# EAGLE design lichtschranke (EAGLE 5.10)
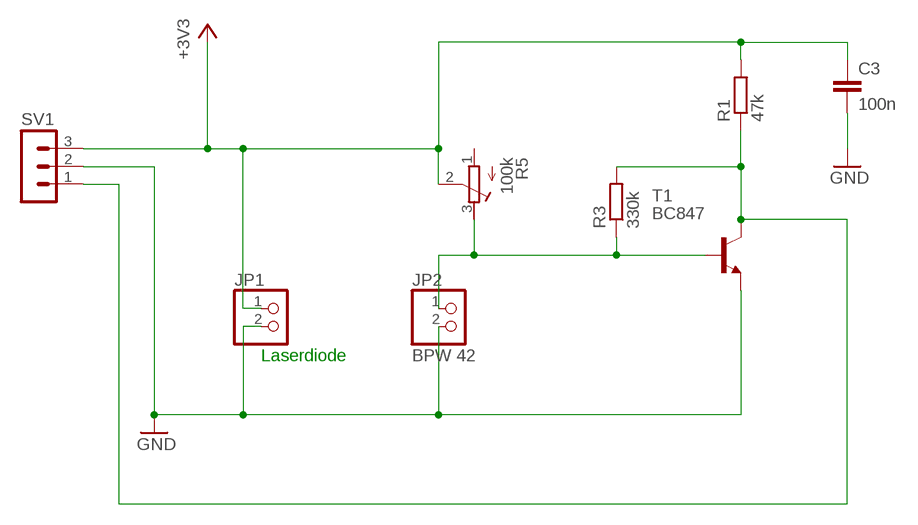
[diagram p0: schematic, sheet 1]

## Parts
C3  100n  C-EUC0805  [C0805]
JP1  PINHD-1X2  [1X02]
JP2  BPW 42  PINHD-1X2/90  [1X02/90]
R1  47k  R-EU_0207/7  [0207/7]
R3  330k  R-EU_M0805  [M0805]
R5  100k  R-TRIMM64W  [RTRIM64W]
SV1  MA03-1  [MA03-1]
T1  BC847  [SOT23]

## Nets
+3V3: C3.1 JP1.1 R1.2 R5.2(S) SV1.3
GND: C3.2 JP1.2 JP2.2 SV1.2 T1.2(E)
N$1: R1.1 R3.2 SV1.1 T1.3(C)
N$2: JP2.1 R3.1 R5.3(A) T1.1(B)
Unconnected: R5.1(E)

## Notes on the sheet
- Laserdiode

## Library data of the parts
C3 = rcl:C-EU: CAPACITOR, European symbol
JP1 JP2 = pinhead:PINHD-1X2: PIN HEADER
R1 = resistor:R-EU_: RESISTOR, European symbol
R3 = rcl:R-EU_: RESISTOR, European symbol
R5 = rcl:R-TRIMM: Trimm resistor
SV1 = con-lstb:MA03-1: PIN HEADER
T1 = transistor-neu-to92:BC847: NPN TRANSISTOR

## Net classes
0 default: clearance 0.127 mm

## Board
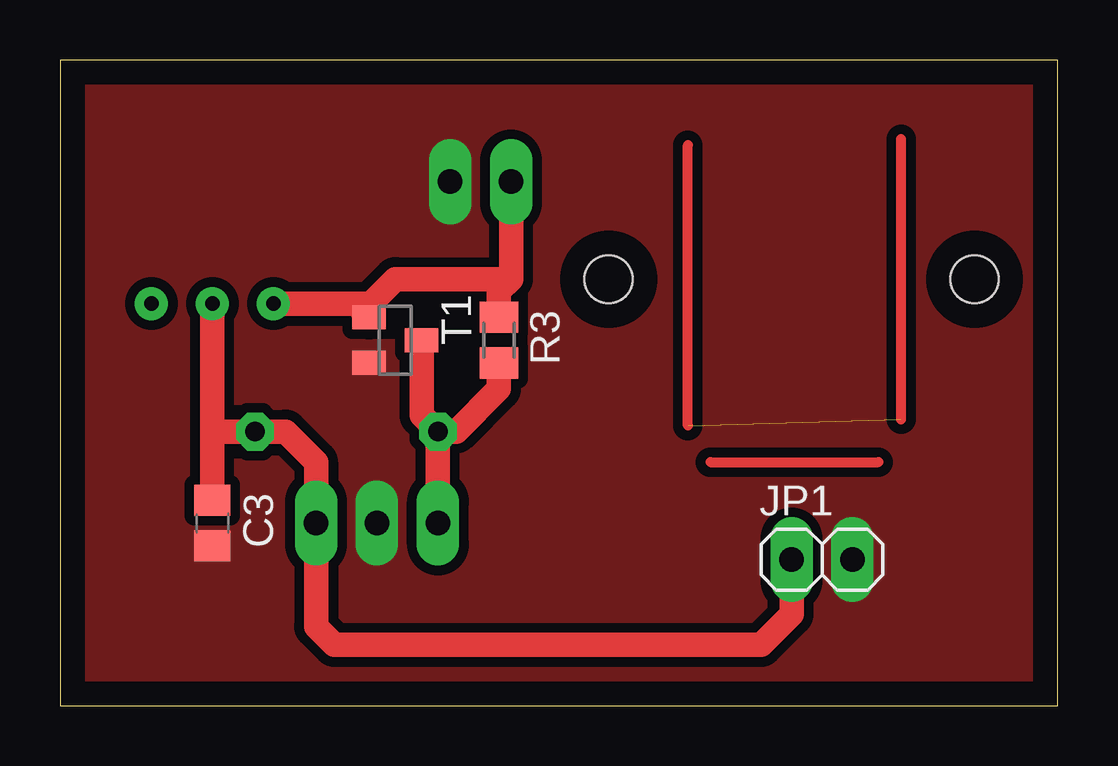
[diagram p1: board, top side]
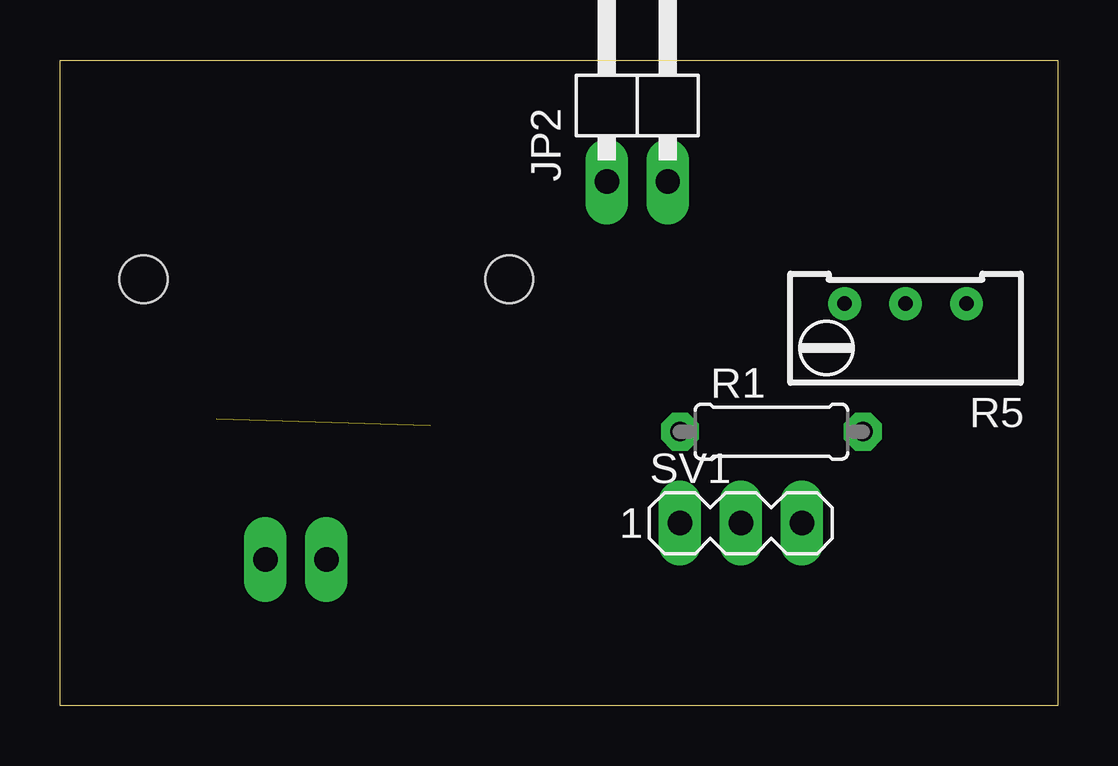
[diagram p2: board, bottom side, seen from below]

Size 41.58 x 26.91 mm. Coordinates in mm from the lower left corner, seen from the top.
Outline: 0,0 41.58,0 41.58,26.91 0,26.91 0,0
Copper layers (1*16): Top 0.035mm / dielectric 1.5mm / Bottom 0.035mm
Design rules "default *": minimum track width 10mil, minimum drill 24mil, track to track 8mil, track to pad 8mil, pad to pad 8mil, via to via 8mil, smd to smd 8mil, copper to edge 40mil, drill to drill 8mil, minimum pad ring 15mil, minimum via ring 8mil, stop-mask expansion 4mil, vias tented up to drill 0mil, thermal gap 10mil
Holes 2 mm at 38.1,17.78 22.86,17.78

### Footprints (pad centres in the part's own frame; a part is rotated, then mirrored left to right if it is on the bottom)
C0805 = smd 1.3 x 1.5: 1 -0.95,0; 2 0.95,0
1X02 = drill 1.016 long: 1 -1.27,0; 2 1.27,0
1X02/90 = drill 1.016 long: 1 -1.27,-3.81; 2 1.27,-3.81
0207/7 = drill 0.813 octagon: 1 -3.81,0; 2 3.81,0
M0805 = smd 1.3 x 1.6: 1 -0.95,0; 2 0.95,0
RTRIM64W = drill 0.61 round: 1 1.27,-2.54; 2 1.27,0; 3 1.27,2.54
MA03-1 = drill 1.016 long: 1 -2.54,0; 2 0,0; 3 2.54,0
SOT23 = smd 1 x 1.4: 1 -0.95,-1.1; 2 0.95,-1.1; 3 0,1.1

### Placement (x,y rotation side)
C3  6.35,7.62 270 top
JP1  31.75,6.1 0 top
JP2  17.53,25.65 0 bottom
R1  11.94,11.43 0 bottom
R3  18.29,15.24 270 top
R5  6.35,15.49 90 bottom
SV1  13.21,7.62 0 bottom
T1  13.97,15.24 270 top

### Tracks (layer width: path | path; a pad name or v marks a point on that pad's centre or on a via)
+3V3
  Top 1.016: 6.35,11.43 R1.2 9.4,11.43 10.67,10.16 SV1.3 10.67,3.3 11.43,2.54 29.21,2.54 30.48,3.81 JP1.1 | C3.1 6.35,11.43 | 6.35,11.43 R5.2
GND
  pour Top (isolate 0.406, no thermals): 0,27.18 0,0 41.66,0 41.66,27.18
N$1
  Top 1.016: SV1.1 R1.1 | T1.3 15.07,12.11 R1.1 | R3.2 18.29,13.21 16.51,11.43 R1.1
N$2
  Top 1.016: 18.8,17.78 JP2.1 | T1.1 12.87,16.68 13.97,17.78 18.8,17.78 | T1.1 12.55,16.51 | R5.3 12.87,16.76 T1.1 | R3.1 18.29,17.27 18.8,17.78
N$3
  Top 0.406: 27.1,10.16 34.1,10.16
N$4  (1 unrouted)
  Top 0.406: 26.16,11.68 26.16,23.37 | 35.05,11.94 35.05,23.62